# Altium schematic sheet sb-sonata-expandheader2.SchDoc: Additional Expansion Pins
size Letter; Organization: NewAE Technology Inc.; Address1: 1083 Queen St., Suite 196; Address2: Halifax; Address3: NS; Address4: Canada B3H 0B2; DocumentNumber: .; Revision: .; SheetNumber: 22; SheetTotal: 22; SheetApproved: YES
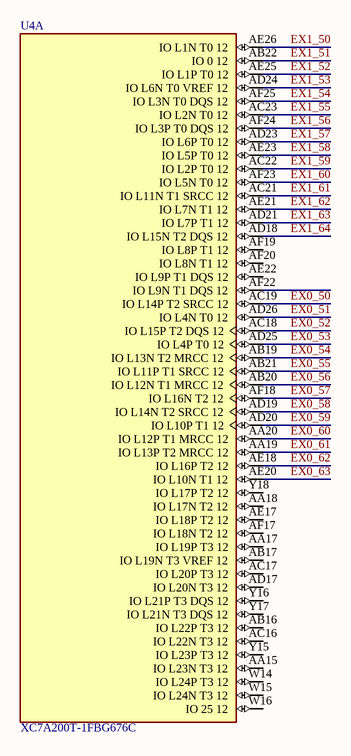
[diagram p0: sb-sonata-expandheader2.SchDoc]

## Parts
U4  XC7A200T-1FBG676C  [FP-XC7A200T-1FBG676C-MFG]  (part A of 14)

## Nets
EX0_50: U4.AC19(IO_L14P_T2_SRCC_12)
EX0_51: U4.AD26(IO_L4N_T0_12)
EX0_52: U4.AC18(IO_L15P_T2_DQS_12)
EX0_53: U4.AD25(IO_L4P_T0_12)
EX0_54: U4.AB19(IO_L13N_T2_MRCC_12)
EX0_55: U4.AB21(IO_L11P_T1_SRCC_12)
EX0_56: U4.AB20(IO_L12N_T1_MRCC_12)
EX0_57: U4.AF18(IO_L16N_T2_12)
EX0_58: U4.AD19(IO_L14N_T2_SRCC_12)
EX0_59: U4.AD20(IO_L10P_T1_12)
EX0_60: U4.AA20(IO_L12P_T1_MRCC_12)
EX0_61: U4.AA19(IO_L13P_T2_MRCC_12)
EX0_62: U4.AE18(IO_L16P_T2_12)
EX0_63: U4.AE20(IO_L10N_T1_12)
EX1_50: U4.AE26(IO_L1N_T0_12)
EX1_51: U4.AB22(IO_0_12)
EX1_52: U4.AE25(IO_L1P_T0_12)
EX1_53: U4.AD24(IO_L6N_T0_VREF_12)
EX1_54: U4.AF25(IO_L3N_T0_DQS_12)
EX1_55: U4.AC23(IO_L2N_T0_12)
EX1_56: U4.AF24(IO_L3P_T0_DQS_12)
EX1_57: U4.AD23(IO_L6P_T0_12)
EX1_58: U4.AE23(IO_L5P_T0_12)
EX1_59: U4.AC22(IO_L2P_T0_12)
EX1_60: U4.AF23(IO_L5N_T0_12)
EX1_61: U4.AC21(IO_L11N_T1_SRCC_12)
EX1_62: U4.AE21(IO_L7N_T1_12)
EX1_63: U4.AD21(IO_L7P_T1_12)
EX1_64: U4.AD18(IO_L15N_T2_DQS_12)

Not connected (* = marked no-connect by the designer): U4 AA15(IO_L23N_T3_12) AA17(IO_L19P_T3_12) AA18(IO_L17N_T2_12) AB16(IO_L22P_T3_12) AB17(IO_L19N_T3_VREF_12) AC16(IO_L22N_T3_12) AC17(IO_L20P_T3_12) AD17(IO_L20N_T3_12) AE17(IO_L18P_T2_12) AE22(IO_L9P_T1_DQS_12) AF17(IO_L18N_T2_12) AF19(IO_L8P_T1_12) AF20(IO_L8N_T1_12) AF22(IO_L9N_T1_DQS_12) W14(IO_L24P_T3_12) W15(IO_L24N_T3_12) W16(IO_25_12) Y15(IO_L23P_T3_12) Y16(IO_L21P_T3_DQS_12) Y17(IO_L21N_T3_DQS_12) Y18(IO_L17P_T2_12)

## Notes on the sheet
- Title:
- Date:
- Rev:
- Time:
- Project:
- Sheet
- of
- License:
- Copyright © NewAE Technology Inc.
- Approved:
- NewAE.com
- File:

## Library data of the parts
U4 = CMP-0364-00015-4: IC FPGA 400 I/O 676FCBGA; Manufacturer: Xilinx; Min Supply Voltage: 0.95V; Number Of Logic Elements Cells: 215360; Ciiva Ids: 8919048; Memory Type: DDR3; Max Supply Voltage: 1.05V; Number Of Registers: 269200; Number Of I/Os: 500; Max Junction Temp: +85°C; Ram Size: 13455360bits; Number Of Logic Blocks: 16825; Standoff Height: 0.4mm; Speed Grade: 1; Import Ts: 1521861070; Memory Size: 1GBytes; Lead Free: Yes; Height: 2.54mm; Octopart: https://octopart.com/xc7a200t-1fbg676c-xilinx-27810760; Ipc Land Pattern Name: BGA676C100P26X26_2700X2700X234; Manufacturer Part Number: XC7A200T-1FBG676C; Package: 0; Device Class L1: Integrated Circuits (ICs); Device Class L3: FPGAs - Field Programmable Gate Arrays; Temperature: 0°C to +85°C; Release Date: 1402465632; Temperature Range High: +85°C; Device Class L2: Embedded Processors and Controllers; RoHS: TRUE; ComponentLink2URL: https://www.xilinx.com/support/documentation/data_sheets/ds181_Artix_7_Data_Sheet.pdf; Temperature Range Low: 0°C; Digikey Description: IC FPGA 400 I/O 676FCBGA; Footprint Url: https://www.xilinx.com/support/documentation/user_guides/ug475_7Series_Pkg_Pinout.pdf; Automotive: No; Category: IC; ComponentLink2Description: Datasheet